# Altium schematic sheet Rectifier-SinglePhase-FullControlled-TCA785.SchDoc
size A4; SheetNumber: 1; SheetTotal: 1
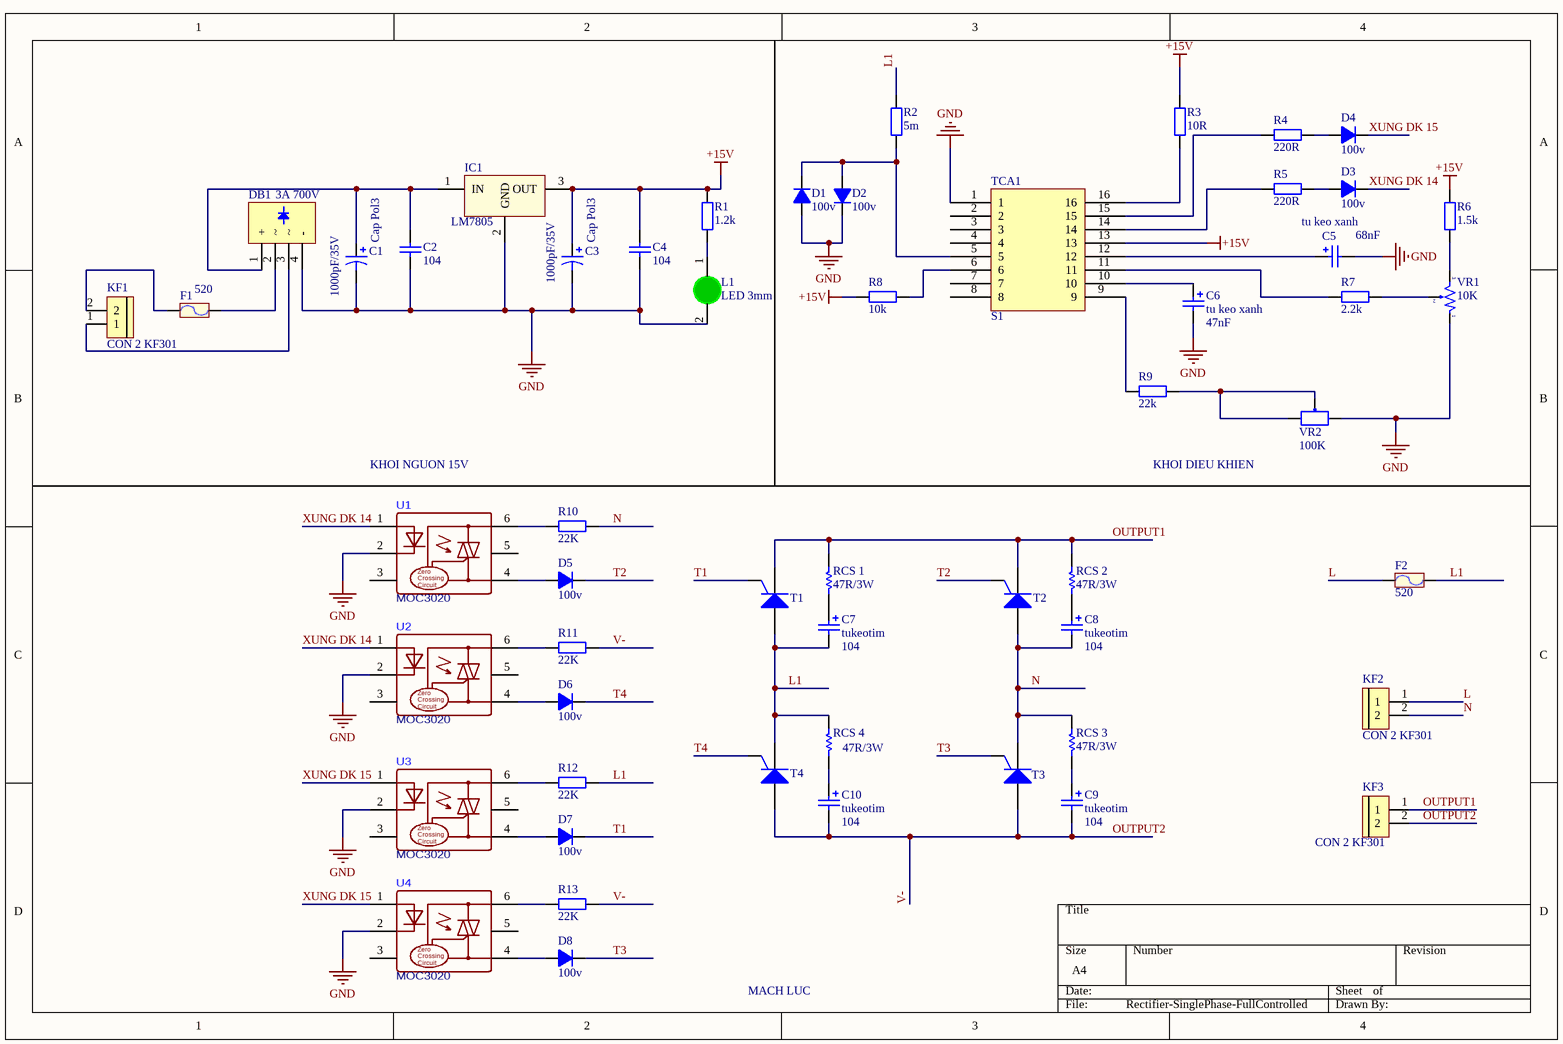
[diagram p0: Rectifier-SinglePhase-FullControlled-TCA785.SchDoc]

## Parts
C1  Cap Pol3  value 1000pF/35V  [CP2/5]
C2  104  [tu gom]
C3  Cap Pol3  value 1000pF/35V  [CP2/5]
C4  104  [tu gom]
C5  tu keo xanh  value 68nF  [tu keo xanh]
C6  tu keo xanh  value 47nF  [tu keo xanh]
C7  tukeotim  value 104  [tu keo]
C8  tukeotim  value 104  [tu keo]
C9  tukeotim  value 104  [tu keo]
C10  tukeotim  value 104  [tu keo]
D1  100v  [DIODE 1A]
D2  100v  [DIODE 1A]
D3  100v  [DIODE 1A]
D4  100v  [DIODE 1A]
D5  100v  [DIODE 1A]
D6  100v  [DIODE 1A]
D7  100v  [DIODE 1A]
D8  100v  [DIODE 1A]
DB1  3A 700V  [DIODE CAU 2A 3A CAM]
F1  520  [De Cau Chi 520 630]
F2  520  [De Cau Chi 520 630]
IC1  LM7805  [QTO-220]
KF1  CON 2 KF301  [Con 2 KF301 5.08]
KF2  CON 2 KF301  [Con 2 KF301 5.08]
KF3  CON 2 KF301  [Con 2 KF301 5.08]
L1  LED 3mm  [LED-3MM-GREEN]
R1  1.2k  [tro vach 1/4w]
R2  5m  [tro vach 1/4w]
R3  10R  [tro vach 1/4w]
R4  220R  [tro vach 1/4w]
R5  220R  [tro vach 1/4w]
R6  1.5k  [tro vach 1/4w]
R7  2.2k  [tro vach 1/4w]
R8  10k  [tro vach 1/4w]
R9  22k  [tro vach 1/4w]
R10  22K  [tro vach 1/4w]
R11  22K  [tro vach 1/4w]
R12  22K  [tro vach 1/4w]
R13  22K  [tro vach 1/4w]
RCS_1  value 47R/3W  [TRO CONG SUAT]  (hidden comment: Res)
RCS_2  value 47R/3W  [TRO CONG SUAT]  (hidden comment: Res)
RCS_3  value 47R/3W  [TRO CONG SUAT]  (hidden comment: Res)
RCS_4  value 47R/3W  [TRO CONG SUAT]  (hidden comment: Res)
T1  SCR Thyristror  [scr]  (value not drawn)
T2  SCR Thyristror  [scr]  (value not drawn)
T3  SCR Thyristror  [scr]  (value not drawn)
T4  SCR Thyristror  [scr]  (value not drawn)
TCA1  S1  [DIP16/W0.3 - duplicate]
U1  MOC3020  [DIP6]
U2  MOC3020  [DIP6]
U3  MOC3020  [DIP6]
U4  MOC3020  [DIP6]
VR1  10K  [Bien Tro Volume Don]
VR2  100K  [Bien Tro Vi Chinh Dung]

## Nets
+15V: C3.1 C4.1 IC1.3(OUT) R1.2 R3.2 R6.1 R8.2 TCA1.13
GND: C1.2 C2.2 C3.2 C4.2 C5.2 C6.2 D1.1(A) D2.2(K) DB1.4(-) IC1.2(GND) L1.2(K) TCA1.1 U1.2(K) U2.2(K) U3.2(K) U4.2(K) VR1.1 VR2.3
L: F2.1 KF2.1
L1: C7.2 F2.2 R2.2 R12.1 RCS_4.2 T1.2(A) T4.1(K)
N: C8.2 KF2.2 R10.1 RCS_3.2 T2.2(A) T3.1(K)
OUTPUT1: KF3.1 RCS_1.2 RCS_2.2 T1.1(K) T2.1(K)
OUTPUT2: C9.2 C10.2 KF3.2 R11.1 R13.1 T3.2(A) T4.2(A)  [also labelled V-]
T1: D7.2(K) T1.3(G)
T2: D5.2(K) T2.3(G)
T3: D8.2(K) T3.3(G)
T4: D6.2(K) T4.3(G)
XUNG DK 14: D3.2(K) U1.1(A) U2.1(A)
XUNG DK 15: D4.2(K) U3.1(A) U4.1(A)
NetC1_1: C1.1 C2.1 DB1.1(+) IC1.1(IN)
NetC5_1: C5.1 TCA1.12
NetC6_1: C6.1 TCA1.10
NetC7_1: C7.1 RCS_1.1
NetC8_1: C8.1 RCS_2.1
NetC9_1: C9.1 RCS_3.1
NetC10_1: C10.1 RCS_4.1
NetD1_2: D1.2(K) D2.1(A) R2.1 TCA1.5
NetD3_1: D3.1(A) R5.1
NetD4_1: D4.1(A) R4.1
NetD5_1: D5.1(A) U1.4(MT)
NetD6_1: D6.1(A) U2.4(MT)
NetD7_1: D7.1(A) U3.4(MT)
NetD8_1: D8.1(A) U4.4(MT)
NetDB1_2: DB1.2 F1.2
NetDB1_3: DB1.3 KF1.1
NetF1_1: F1.1 KF1.2
NetL1_1: L1.1(A) R1.1
NetR3_1: R3.1 TCA1.16
NetR4_2: R4.2 TCA1.15
NetR5_2: R5.2 TCA1.14
NetR6_2: R6.2 VR1.3
NetR7_1: R7.1 VR1.2
NetR7_2: R7.2 TCA1.11
NetR8_1: R8.1 TCA1.6
NetR9_1: R9.1 VR2.1 VR2.2
NetR9_2: R9.2 TCA1.9
NetR10_2: R10.2 U1.6(MT)
NetR11_2: R11.2 U2.6(MT)
NetR12_2: R12.2 U3.6(MT)
NetR13_2: R13.2 U4.6(MT)

Not connected (* = marked no-connect by the designer): TCA1 2 3 4 7 8; U1 3(NC) 5(NC); U2 3(NC) 5(NC); U3 3(NC) 5(NC); U4 3(NC) 5(NC)

## Notes on the sheet
- KHOI NGUON 15V
- KHOI DIEU KHIEN
- MACH LUC
- (in symbol MOC3063M) Zero / Crossing / Circuit

## Library data of the parts
C1 C3 = Cap Pol3_3: Polarized Capacitor (Surface Mount); VALUE: C?; LatestRevisionDate: 17-Jul-2002; LatestRevisionNote: Re-released for DXP Platform.; PackageReference: C0805; Publisher: Altium Limited
C2 C4 = Tu gom 104 50V: Cắm; So_Chan: 2; Ten_Linh_Kien: Tụ gốm 104 100nF 50V; Don_Vi: Con; Ma_Hang: MH004761; Chung_Loai: Cắm; Kieu_Chan: *
C5 C6 = tu keo xanh: Polarized Capacitor (Surface Mount); VALUE: C?; LatestRevisionDate: 17-Jul-2002; LatestRevisionNote: Re-released for DXP Platform.; PackageReference: C0805; Publisher: Altium Limited
C7-C10 = tu keo tim: Polarized Capacitor (Surface Mount); VALUE: C?; LatestRevisionDate: 17-Jul-2002; LatestRevisionNote: Re-released for DXP Platform.; PackageReference: C0805; Publisher: Altium Limited
D1-D8 = Diode 1N4007: Cắm; Ten_Linh_Kien: Diode 1N4007 1A (DIP); Don_Vi: Con; Ma_Hang: MH001063; Ghi Chu: *; Kieu_Chan: *; Chung_Loai: Cắm
DB1 = Diode CAU 3A: Cắm; Ten_Linh_Kien: Diode Cầu 3A 700V KBP307 ( Vuông); Don_Vi: Con; Ma_Hang: MH001207; Ghi_Chu: *; Kieu_Chan: *; Chung_Loai: cắm
F1 F2 = De Cau Chi 520 630: 5x20mm; Ma_Hang: MH001473; Ten: Đế Cầu Chì 5x20MM 6x30MM SMD01
IC1 = LM78xx: On ap +, from + 5 to + 24VDC; Value: LM7805
KF1-KF3 = CON 2 KF301: Cắm; Ma_Hang: MH000987; Ten_Linh_Kien: CON 2 KF301-2P 5.08MM Xanh Dương; Chung_Loai: Cắm; Ghi_Chu: *; Kieu_Chan: *; Don_Vi: Con
L1 = LED 3mm Xanh La: Cắm; Don_Vi: Con; Ma_Hang: MH001054; Ten_Linh_Kien: Led 3MM Phủ Xanh (10c); Ghi_Chu: *; Kieu_Chan: *; Chung_Loai: Cắm
R1-R13 = Tro Vach 1/4W 5% 1.2R: Cắm; Don_Vi: Con; So_Chan: 2; Ten_Linh_Kien: Trở Vạch 1/4w 5% 1.2R; Ma_Hang: MH007350; Chung_Loai: Cắm; Kieu_Chan: *
RCS_1-RCS_4 = TRO CONG SUAT: Resistor; Manufacturer: Generic Components; Class: Passive; Published: 08/06/2000; Publisher: Altium Hobart Technology Centre; SubClass: Resistor
T1-T4 = SCR_1: IH: 50MA; IGT: 40MA; TON: 1US; VTMIN: 1V; VDRM: 50V; DVDT: 50MEG; TQ: 20US; K1: 1; SimulationGenericComponent: True; K2: 1
TCA1 = TCA 785
U1-U4 = MOC3063M
VR1 = Triet Ap Don 5k: Cắm; Don_Vi: Con; Ten_Linh_Kien: Triết Áp Đơn B5K; Ma_Hang: MH001416; Kieu_Chan: *; Chung_Loai: Cắm
VR2 = Bien Tro Tinh Chinh 100R Dung: Cắm; Don_Vi: Con; Ten_Linh_Kien: Biến Trở VR 101-100R 3296W; Ma_Hang: MH003235; Kieu_Chan: *; Chung_Loai: Cắm